# EasyEDA schematic 1-Schematic_RUBBER_DUCKY.json
TITLE: Sheet_1; REV: 1.0; Date: 2022-12-25; Sheet: 1/1; Drawn By: maarnotto; Company: Your Company
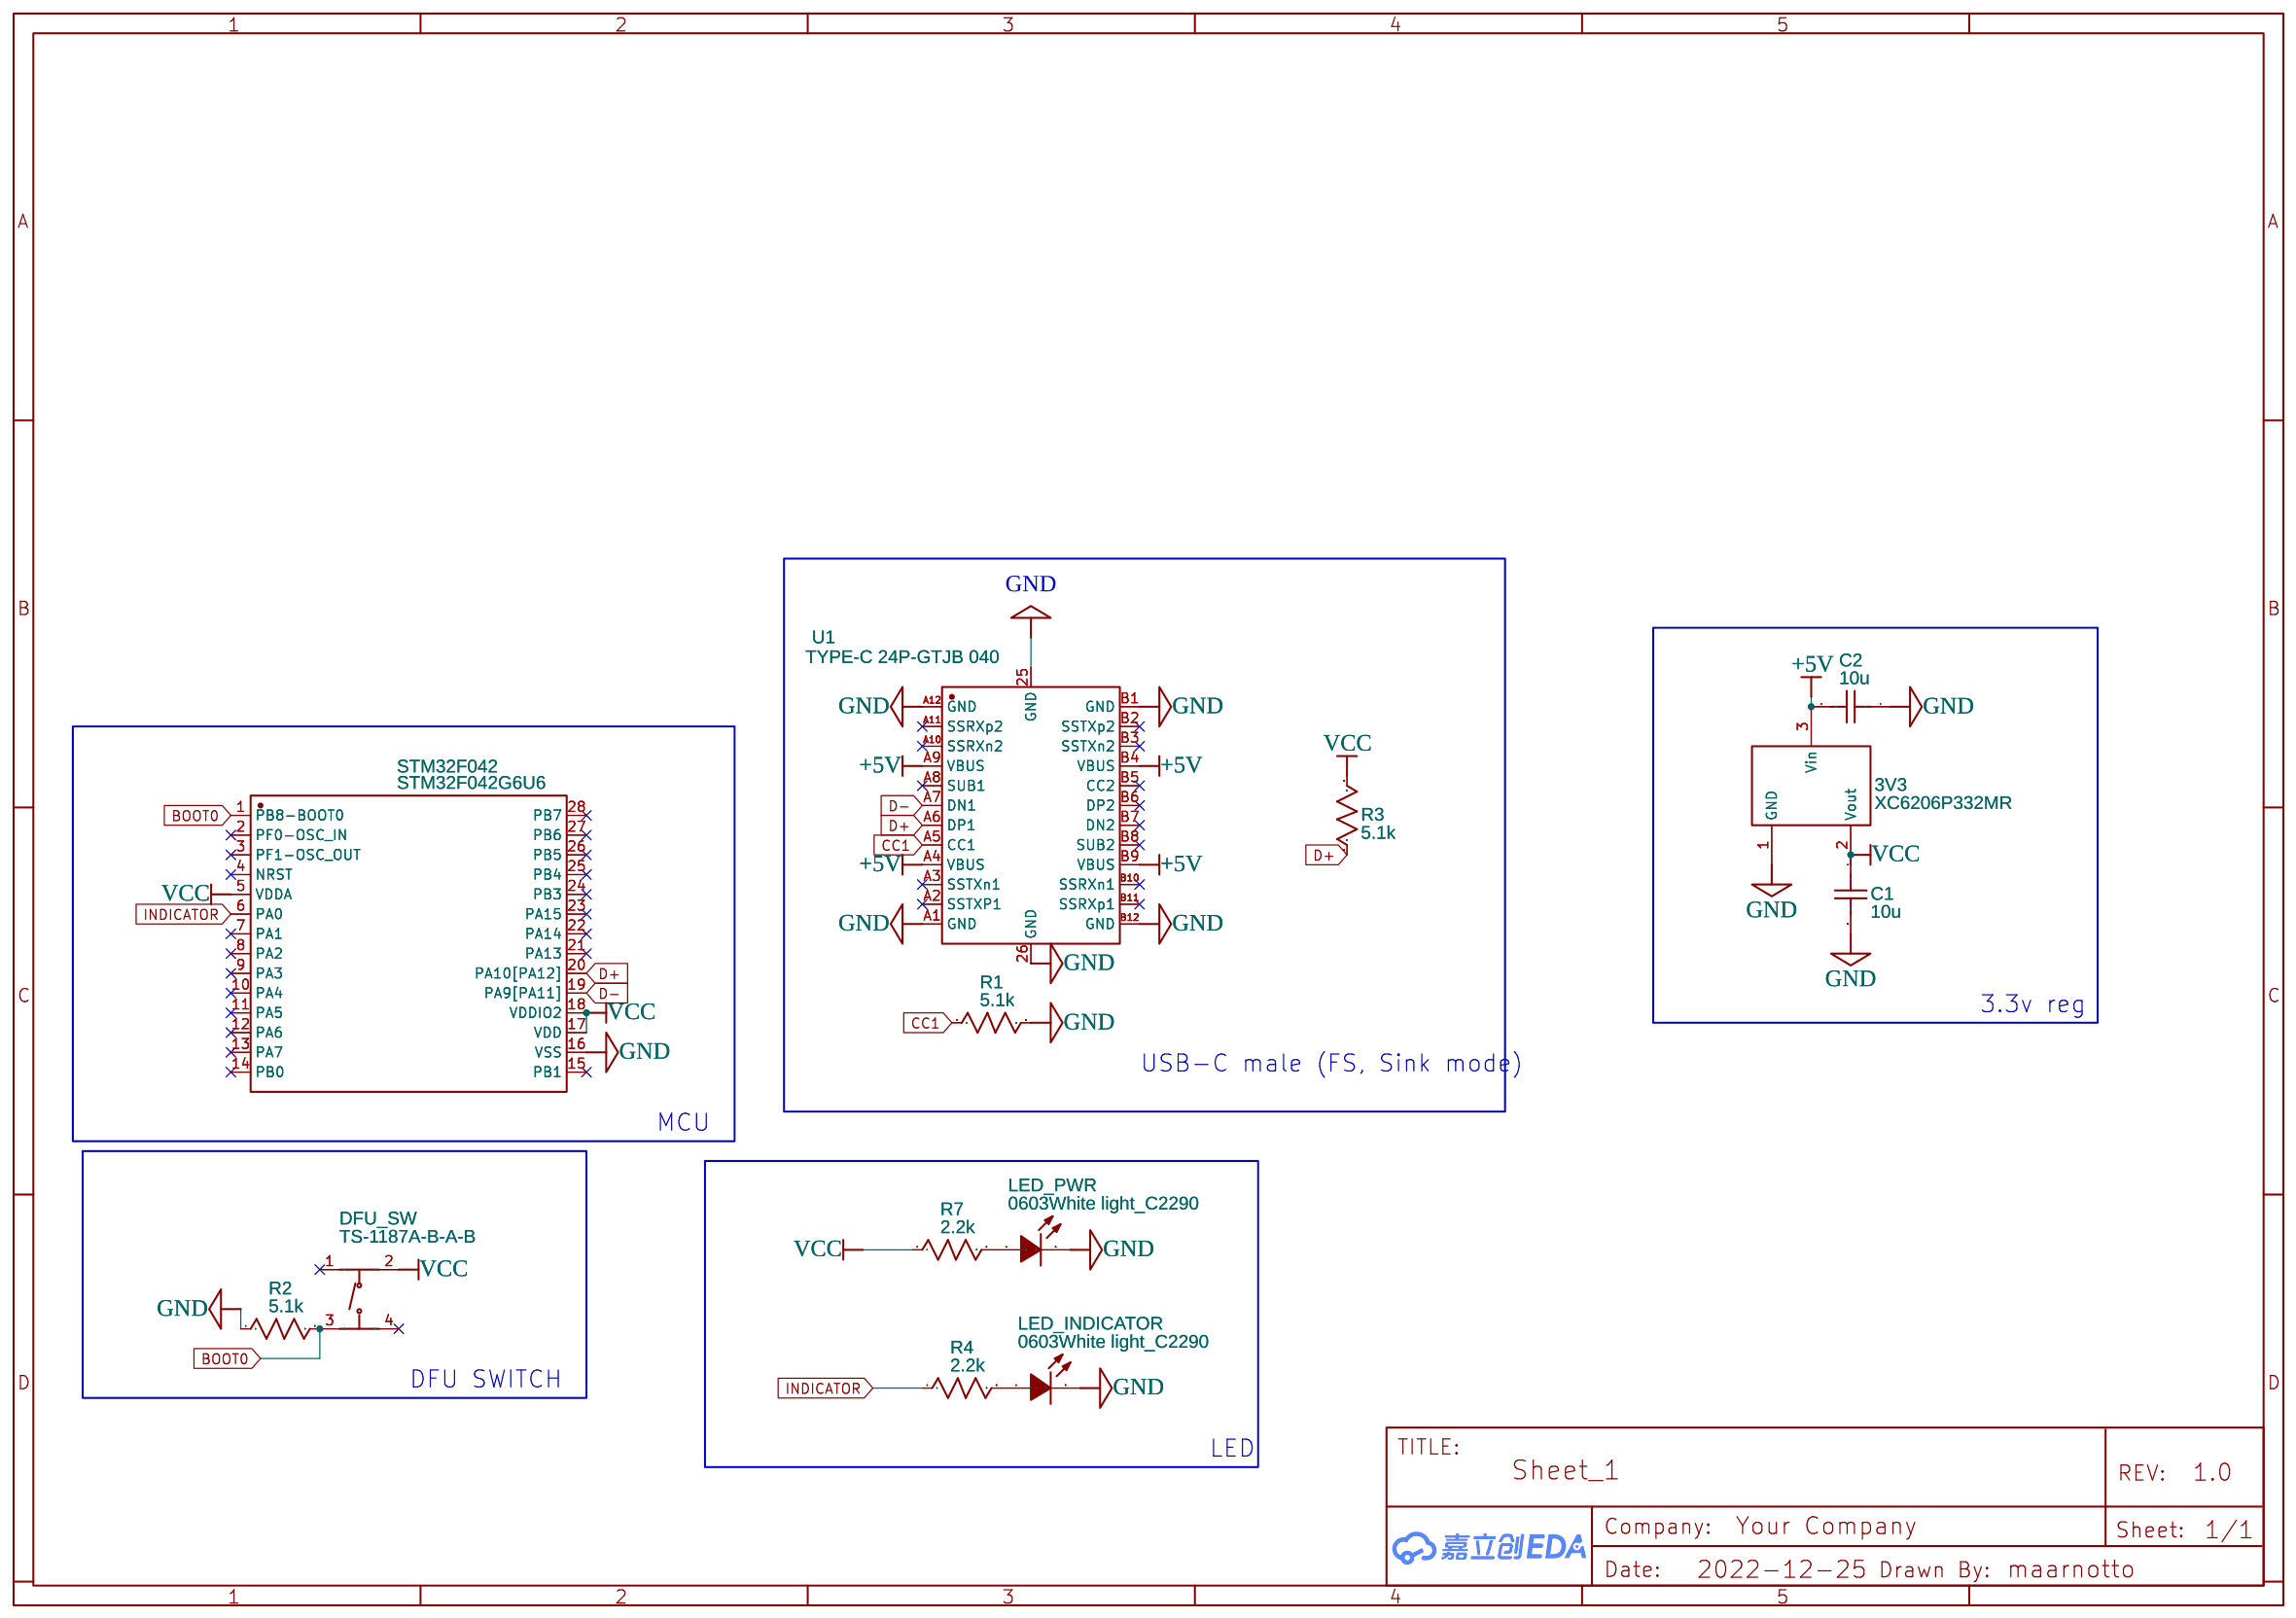
[diagram p0: schematic sheet]

## Parts
3V3  XC6206P332MR  [SOT-23-3_L2.9-W1.6-P1.90-LS2.8-BR]
C1  10u  [C0603]
C2  10u  [C0603]
DFU_SW  TS-1187A-B-A-B  [SW-SMD_4P-L5.1-W5.1-P3.70-LS6.5-TL-2]
LED_INDICATOR  0603White light_C2290  [LED0603-R-RD_WHITE]
LED_PWR  0603White light_C2290  [LED0603-R-RD_WHITE]
R1  5.1k  [R0603]
R2  5.1k  [R0603]
R3  5.1k  [R0603]
R4  2.2k  [R0603]
R7  2.2k  [R0603]
STM32F042  STM32F042G6U6  [UFQFPN-28_L4.0-W4.0-P0.50-BL]
U1  TYPE-C 24P-GTJB 040  [USB-C-SMD_TYPE-C-24P-GTJB-040]

## Library data of the parts
3V3 = XC6206P332MR: Supplier: LCSC; Manufacturer: TOREX(特瑞仕); Supplier Part: C5446; JLCPCB Part Class: Basic Part
C1 C2 = C_0603_US: Contributor: LCEDA_Lib
DFU_SW = TS-1187A-B-A-B: Supplier: LCSC; Supplier Part: C318884; Manufacturer: XKB Connectivity(中国星坤); Contributor: LCSC; JLCPCB Part Class: Basic Part
LED_INDICATOR LED_PWR = 0603White light_C2290: Supplier: LCSC; Manufacturer: null; Manufacturer Part: KT-0603白灯; Supplier Part: C2290; JLCPCB Part Class: Basic Part
R1-R4 R7 = R_0603_US: Contributor: LCEDA_Lib
STM32F042 = STM32F042G6U6: Contributor: LCSC; Supplier: LCSC; Supplier Part: C961597; Manufacturer: ST(意法半导体); JLCPCB Part Class: Extended Part
U1 = TYPE-C 24P-GTJB 040: Supplier: LCSC; Supplier Part: C3151751; Manufacturer: SHOU HAN(首韩); Contributor: lcsc; JLCPCB Part Class: Extended Part

## Nets
+5V: 3V3.3(Vin) C2.2 U1.A4(VBUS) U1.A9(VBUS) U1.B4(VBUS) U1.B9(VBUS)
GND: 3V3.1(GND) C1.2 C2.1 LED_INDICATOR.2(K) LED_PWR.2(K) R1.2 R2.1 STM32F042.16(VSS) U1.25(GND) U1.26(GND) U1.A1(GND) U1.A12(GND) U1.B1(GND) U1.B12(GND)
VCC: 3V3.2(Vout) C1.1 DFU_SW.2(B) R3.1 R7.1 STM32F042.5(VDDA) STM32F042.17(VDD) STM32F042.18(VDDIO2)
BOOT0: DFU_SW.3(C) R2.2 STM32F042.1(PB8-BOOT0)
CC1: R1.1 U1.A5(CC1)
D+: R3.2 STM32F042.20(PA10[PA12]) U1.A6(DP1)
D-: STM32F042.19(PA9[PA11]) U1.A7(DN1)
INDICATOR: R4.1 STM32F042.6(PA0)
Net-(LED_INDICATOR-1): LED_INDICATOR.1(A) R4.2
Net-(LED_PWR-1): LED_PWR.1(A) R7.2

Not connected (* = marked no-connect by the designer): DFU_SW 1(A)* 4(D)*; STM32F042 2(PF0-OSC_IN)* 3(PF1-OSC_OUT)* 4(NRST)* 7(PA1)* 8(PA2)* 9(PA3)* 10(PA4)* 11(PA5)* 12(PA6)* 13(PA7)* 14(PB0)* 15(PB1)* 21(PA13)* 22(PA14)* 23(PA15)* 24(PB3)* 25(PB4)* 26(PB5)* 27(PB6)* 28(PB7)*; U1 A2(SSTXP1)* A3(SSTXn1)* A8(SUB1)* A10(SSRXn2)* A11(SSRXp2)* B2(SSTXp2)* B3(SSTXn2)* B5(CC2)* B6(DP2)* B7(DN2)* B8(SUB2)* B10(SSRXn1)* B11(SSRXp1)*

## Notes on the sheet
- 3.3v reg
- USB-C male (FS, Sink mode)
- MCU
- DFU SWITCH
- LED
